# Altium schematic sheet CHIBI_INPUT2_20171126.SchDoc: Title
size A2; ApprovedBy: Enter Name; CheckedBy: Enter Name; DrawnBy: Enter Name; Organization: Tymphany; Address1: 2/F, BBK Building; Address2: No. 89 Ande Street, Shang Meilin; Address3: Futian District, Shenzhen; Address4: GuangDong, P.R.C. 518049, China; DocumentNumber: 2; Revision: 0.0.0; SheetNumber: 2; SheetTotal: 6; ProductName: Product Name; PartNumber: Part Number; ModifiedBy: Enter Name; LeadEngineer: Enter Name; Stage: Concept; ProjectName: Project Name
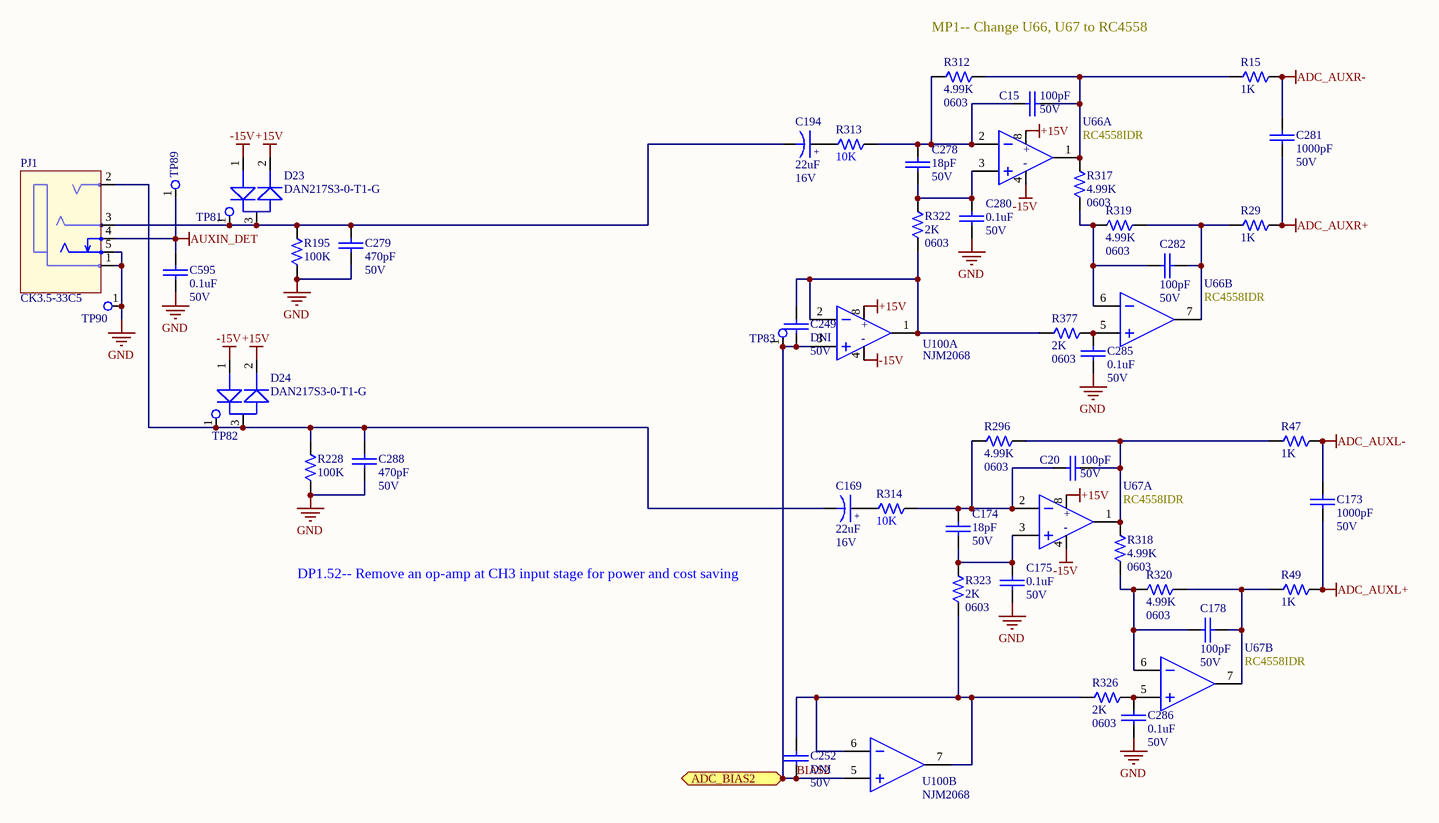
[diagram p0: CHIBI_INPUT2_20171126.SchDoc]

## Parts
C15  value 100pF  Voltage: 50V  [CAPC0603-RW]  (hidden comment: PXL410370-1010)
C20  value 100pF  Voltage: 50V  [CAPC0603-RW]  (hidden comment: PXL410370-1010)
C169  value 22uF  Voltage: 16V  [CASE - B]  (hidden comment: PBE099541-2200)
C173  value 1000pF  Voltage: 50V  [CAPC0603-RW]  (hidden comment: PXL410370-1020)
C174  value 18pF  Voltage: 50V  [CAPC0603-RW]  (hidden comment: PXL410370-1800)
C175  value 0.1uF  Voltage: 50V  [CAPC0603-RW]  (hidden comment: PXL456470-1040)
C178  value 100pF  Voltage: 50V  [CAPC0603-RW]  (hidden comment: PXL410370-1010)
C194  value 22uF  Voltage: 16V  [CASE - B]  (hidden comment: PBE099541-2200)
C249  Voltage: 50V  [CAPC0402-RW]  (hidden comment: DNI)
C252  Voltage: 50V  [CAPC0402-RW]  (hidden comment: DNI)
C278  value 18pF  Voltage: 50V  [CAPC0603-RW]  (hidden comment: PXL410370-1800)
C279  value 470pF  Voltage: 50V  [CAPC0603-RW]  (hidden comment: PXL410370-4710)
C280  value 0.1uF  Voltage: 50V  [CAPC0603-RW]  (hidden comment: PXL456470-1040)
C281  value 1000pF  Voltage: 50V  [CAPC0603-RW]  (hidden comment: PXL410370-1020)
C282  value 100pF  Voltage: 50V  [CAPC0603-RW]  (hidden comment: PXL410370-1010)
C285  value 0.1uF  Voltage: 50V  [CAPC0603-RW]  (hidden comment: PXL456470-1040)
C286  value 0.1uF  Voltage: 50V  [CAPC0603-RW]  (hidden comment: PXL456470-1040)
C288  value 470pF  Voltage: 50V  [CAPC0603-RW]  (hidden comment: PXL410370-4710)
C595  value 0.1uF  Voltage: 50V  [CAPC0402-RW]  (hidden comment: PWL456470-1040)
D23  T572006171251  [SOT323(SC-70)-R]  (value not drawn)
D24  T572006171251  [SOT323(SC-70)-R]  (value not drawn)
PJ1  MFG Part: CK3.5-33C5  [Phone Jack CK3.5-33C5]  (hidden comment: T710200010500)
R15  value 1K  [0402-RW]  (hidden comment: QCF161240-1001)
R29  value 1K  [0402-RW]  (hidden comment: QCF161240-1001)
R47  value 1K  [0402-RW]  (hidden comment: QCF161240-1001)
R49  value 1K  [0402-RW]  (hidden comment: QCF161240-1001)
R195  value 100K  [0603-RW]  (hidden comment: QCF011030-1003)
R228  value 100K  [0603-RW]  (hidden comment: QCF011030-1003)
R296  value 4.99K  PACKAGE: 0603  [0603-RW]  (hidden comment: QCF011030-4991)
R312  value 4.99K  PACKAGE: 0603  [0603-RW]  (hidden comment: QCF011030-4991)
R313  value 10K  [0603-RW]  (hidden comment: QCF011030-1002)
R314  value 10K  [0603-RW]  (hidden comment: QCF011030-1002)
R317  value 4.99K  PACKAGE: 0603  [0603-RW]  (hidden comment: QCF011030-4991)
R318  value 4.99K  PACKAGE: 0603  [0603-RW]  (hidden comment: QCF011030-4991)
R319  value 4.99K  PACKAGE: 0603  [0603-RW]  (hidden comment: QCF011030-4991)
R320  value 4.99K  PACKAGE: 0603  [0603-RW]  (hidden comment: QCF011030-4991)
R322  value 2K  PACKAGE: 0603  [0603-RW]  (hidden comment: QCF011030-2001)
R323  value 2K  PACKAGE: 0603  [0603-RW]  (hidden comment: QCF011030-2001)
R326  value 2K  PACKAGE: 0603  [0603-RW]  (hidden comment: QCF011030-2001)
R377  value 2K  PACKAGE: 0603  [0603-RW]  (hidden comment: QCF011030-2001)
TP81  CON3_2  [TP_1.2mm]  (value not drawn)
TP82  CON3_3  [TP_1.2mm]  (value not drawn)
TP83  CON3_2  [TP_1.2mm]  (value not drawn)
TP89  CON3_2  [TP_1.2mm]  (value not drawn)
TP90  CON3_2  [TP_1.2mm]  (value not drawn)
U66  T610500019101  [D(R-PDSO-G8)]  (value not drawn)  (parts A,B of 2)
U67  T610500019101  [D(R-PDSO-G8)]  (value not drawn)  (parts A,B of 2)
U100  RCI002068-0001  [DMP8]  (value not drawn)  (parts A,B of 2)

## Ports
ADC_BIAS2 (in)

## Nets
+15V: D23.2(K) D24.2(K) U66.8(VCC+) U67.8(VCC+) U100.8
-15V: D23.1(A) D24.1(A) U66.4(VCC-) U67.4(VCC-) U100.4
ADC_AUXL+: C173.2 R49.2
ADC_AUXL-: C173.1 R47.2
ADC_AUXR+: C281.2 R29.2
ADC_AUXR-: C281.1 R15.2
AUXIN_DET: C595.1 PJ1.4 TP89.1
GND: C175.2 C279.2 C280.2 C285.1 C286.1 C288.1 C595.2 PJ1.1 PJ1.5 R195.1 R228.1 TP90.1
BIAS2: C249.2 C252.2 TP83.1 U100.3(IN+) U100.5(IN+) ; port ADC_BIAS2
NetC15_1: C15.1 C278.1 R312.1 R313.2 U66.2(1IN-)
NetC15_2: C15.2 R15.1 R312.2 R317.2 U66.1(1OUT)
NetC20_1: C20.1 C174.1 R296.1 R314.2 U67.2(1IN-)
NetC20_2: C20.2 R47.1 R296.2 R318.2 U67.1(1OUT)
NetC169_1: C169.1 R314.1
NetC169_2: C169.2 C288.2 D24.3(C) PJ1.2 R228.2 TP82.1
NetC174_2: C174.2 C175.1 R323.2 U67.3(1IN+)
NetC178_1: C178.1 R49.1 R320.1 U67.7(2OUT)
NetC178_2: C178.2 R318.1 R320.2 U67.6(2IN-)
NetC194_1: C194.1 R313.1
NetC194_2: C194.2 C279.1 D23.3(C) PJ1.3 R195.2 TP81.1
NetC249_1: C249.1 R322.1 R377.1 U100.1(OUT) U100.2(IN-)
NetC252_1: C252.1 R323.1 R326.1 U100.6(IN-) U100.7(OUT)
NetC278_2: C278.2 C280.1 R322.2 U66.3(1IN+)
NetC282_1: C282.1 R29.1 R319.1 U66.7(2OUT)
NetC282_2: C282.2 R317.1 R319.2 U66.6(2IN-)
NetC285_2: C285.2 R377.2 U66.5(2IN+)
NetC286_2: C286.2 R326.2 U67.5(2IN+)

## Notes on the sheet
- (near R312) MP1-- Change U66, U67 to RC4558
- DP1.52-- Remove an op-amp at CH3 input stage for power and cost saving
- Version
- Date
- Description of Changes/Notes
- Client
- (Hui Zhou) Co. Ltd., Shenzhen Branch
- Premium Loudspeakers
- Product:
- File Name:
- Page Title:
- CHIBI
- CHIBI Main Board
- Requirement of Tymphany Parts:
  1. Comply with Tymphany QSI057-1031 "Green Product Chemical Substances Specification".
  2. Follow customer's specification as required.
  3. Follow Halogen Free requirement: Br<900 ppm, Cl<900 ppm, Br+Cl< 1500 ppm if required.
- www.Tymphany.com
- Tel: + 86 755-339-121-88
- GuangDong, P.R.C. 518049, China
- Futian District, Shenzhen
- No. 89 Ande Street, Shang Meilin
- 2/F, BBK Building
- Revision:
- Stage:
- Lead Engineer:
- Date:
- Part Number:
- SOP(Ver B)
- 3.1.1
- Sam
- T651000009390
- Drawn By:
- Checked By:
- Time:
- Gavin
- Mod By:
- Approved By:
- Sheet:
- Mod Date:
- Size:
- A2
- of
- Seb
- (in symbol CAP E 22uF 16V 20% SMD_CASE-B) +
- (in symbol NJM2068, part A) +; -
- (in symbol RC4558IDR, part A) +; -

## Library data of the parts
C15 C20 C178 C282 = CAP0603 100pF 50V 5% - PXL410370-1010: GP CHIP CAP 100pF 50V 5% 0603 TYPE NPO; SAP: T541021016508; Vendor Code: 10010262; Vendor Name: 东莞市晴远电子有限公司; Type: Capacitor; PACKAGE: CAPC0603; MFG: *; MFG Part: *; Other: NPO; Tolerance: 5%
C169 C194 = CAP E 22uF 16V 20% SMD_CASE-B: E 22UF 16V +-20% 4X5.4M CK1C220M-CRC54 G; SAP: T551220434010; MFG: NORMAL; Tolerance: 20%; Type: Capacitor; PACKAGE: CASE - B; Vendor Name: *; Vendor Code: *; MFG Part: CK1C220M-CRC54; Other: *
C173 C281 = CAP0603 1000pF 50V 5% - PXL410370-1020: CHIP CAP 1000pF 50V 5% 0603 TYPE NPO; SAP: T541021026508; Vendor Code: 10010262; Vendor Name: 东莞市晴远电子有限公司; Type: Capacitor; PACKAGE: CAPC0603; MFG: *; MFG Part: *; Other: NPO; Tolerance: 5%
C174 C278 = CAP0603 18pF 50V 5% - PXL410370-1800: CHIP CAP 18pF 50V 5% 0603 TYPE NPO; SAP: T541021806508; Vendor Code: 10010262; Vendor Name: 东莞市晴远电子有限公司; Type: Capacitor; PACKAGE: CAPC0603; MFG: *; MFG Part: *; Other: NPO; Tolerance: 5%
C175 C280 C285 C286 = CAP0603 0.1uF 50V 10% - PXL456470-1040: GP CHIP CAP 0.1uF 50V 10% 0603 TYPE X7R; SAP: T542021047508; Vendor Code: 10010262; Vendor Name: 东莞市晴远电子有限公司; Type: Capacitor; PACKAGE: CAPC0603; MFG: *; MFG Part: *; Other: X7R; Tolerance: 10%
C249 C252 = CAP0402 0.1uF 50V_10%_X7R_TDK: Other: NP0; Tolerance: 10%; Type: Capacitor; CREATE_NAME: Nathan; SAP: DNI; PACKAGE: CAPC0402; Vendor Name: *; MFG Part: *; CREATE_TIME: 17-Aug-2016; Value: DNI
C279 C288 = CAP0603 470pF 50V 5% - PXL410370-4710: GP CHIP CAP 470pF 50V 5% 0603 NPO; SAP: T541024716508; Vendor Code: 10010262; Vendor Name: 东莞市晴远电子有限公司; Type: Capacitor; PACKAGE: CAPC0603; MFG: *; MFG Part: *; Other: NPO; Tolerance: 5%
C595 = CAP0402 0.1uF 50V 10%: CAP, CER, 0.1uF, 10%, 50V, X7R, 0402, RoHS; SAP: T542011047508; Type: Capacitor; CREATE_NAME: TOM@Deftronics; PACKAGE: CAPC0402; Vendor Name: *; MFG: *; MFG Part: *; Other: X7R; Tolerance: 10%; CREATE_TIME: 13-May-2014
D23 D24 = DAN217S3-0-T1-G: ITC 100V 215MA DAN217S3-0-T1-G CYSTE K; MFG: CYSTECH; Type: DIODES; Create Name: Nathan; SAP: T572006171251; Vendor Name: *; Vendor Code: *; MFG Part: DAN217S3-0-T1-G; Create Time: 08-Sep-2017
PJ1 = PHONE JACK 3.5mm CK3.5-33C5: EARPHONE JACK K; MFG: JINJIA; Value: 3.5mm; CREATE_NAME: Nathan; SAP: T710200010500; Vendor Code: *; Vendor Name: *; Type: Connector; CREATE_TIME: 11-Oct-2015
R15 R29 R47 R49 = RES0402 1/16W 1% 1K OHM: CHIP RES 1K OHM 1/16W 1% 0402; SAP: T502100101399; MFG: WALSIN; Vendor Code: *; Power: *; Vendor Name: *; MFG Part: *; TOL: 1%; Type: Resistor; PACKAGE: 0402
R195 R228 = RES0603 1/10W 1% 100K OHM: GP CHIP RES. 100K OHM 1/10W 1% 0603; Vendor Code: 10010262; SAP: T502100302399; Vendor Name: 东莞市晴远电子有限公司; Power: *; MFG Part: *; MFG: *; TOL: 1%; Type: Resistor; PACKAGE: 0603
R296 R312 R317-R320 = RES0603 1/10W 1% 4.99K OHM: GP CHIP RES. 4.99K OHM 1/10W 1% 0603; Vendor Code: 10010262; SAP: T502499102399; Vendor Name: 东莞市晴远电子有限公司; Power: *; MFG Part: *; MFG: *; TOL: 1%; Type: Resistor
R313 R314 = RES0603 1/10W 1% 10K OHM: GP CHIP RES. 10K OHM 1/10W 1% 0603; Vendor Code: 10010262; SAP: T502100202399; Vendor Name: 东莞市晴远电子有限公司; Power: *; MFG Part: *; MFG: *; TOL: 1%; Type: Resistor; PACKAGE: 0603
R322 R323 R326 R377 = RES0603 1/10W 1% 2K OHM: GP CHIP RES. 2K OHM 1/10W 1% 0603; Vendor Code: 10010262; SAP: T502200102399; Vendor Name: 东莞市晴远电子有限公司; Power: *; MFG Part: *; MFG: *; TOL: 1%; Type: Resistor
TP81-TP83 TP89 TP90 = TP
U66 U67 = RC4558IDR: OP RC4558IDR SOP-8 TI G; CREATE_NAME: Nathan; CREATE_TIME: 16-Aug-2017; MFG: TI; SAP: T610500019101; TYPE: IC; Value: *; Vender Code: *; Vender Name: *; MFG Part: RC4558IDR
U100 = NJM2068: IC OP AMP NJM2068 DUAL SO-8; MFG: JRC; SAP: T610500024606; CREATE_NAME: GordonL@Deftronics; Vendor Code: *; Vendor Name: *; Type: IC; CREATE_TIME: 31-MAY-2013; MFG Part: NJM2068